# Altium schematic sheet 1_P1.schdoc
size 307 x 218 mm; Symbol: Drawing-Symbol_A4; Device: Drawing-Symbol_A4; @Project Name: usb_hub; @Page Count: 1; @Update Date: 2025-07-25; @Create Date: 2025-07-25; @Schematic Name: Schematic1; @Page No: 1; @Page Name: P1; Company: EasyEDA.com; Version: V1.0; Page Size: A4; @Create Time: 13:09:49; @Update Time: 22:19:45; Width: 1170; Height: 825; Region Start: 1; X Region Count: 6; Y Region Count: 4; Blade Width: 10; Title Block Position: 3; @Board Name: Board1
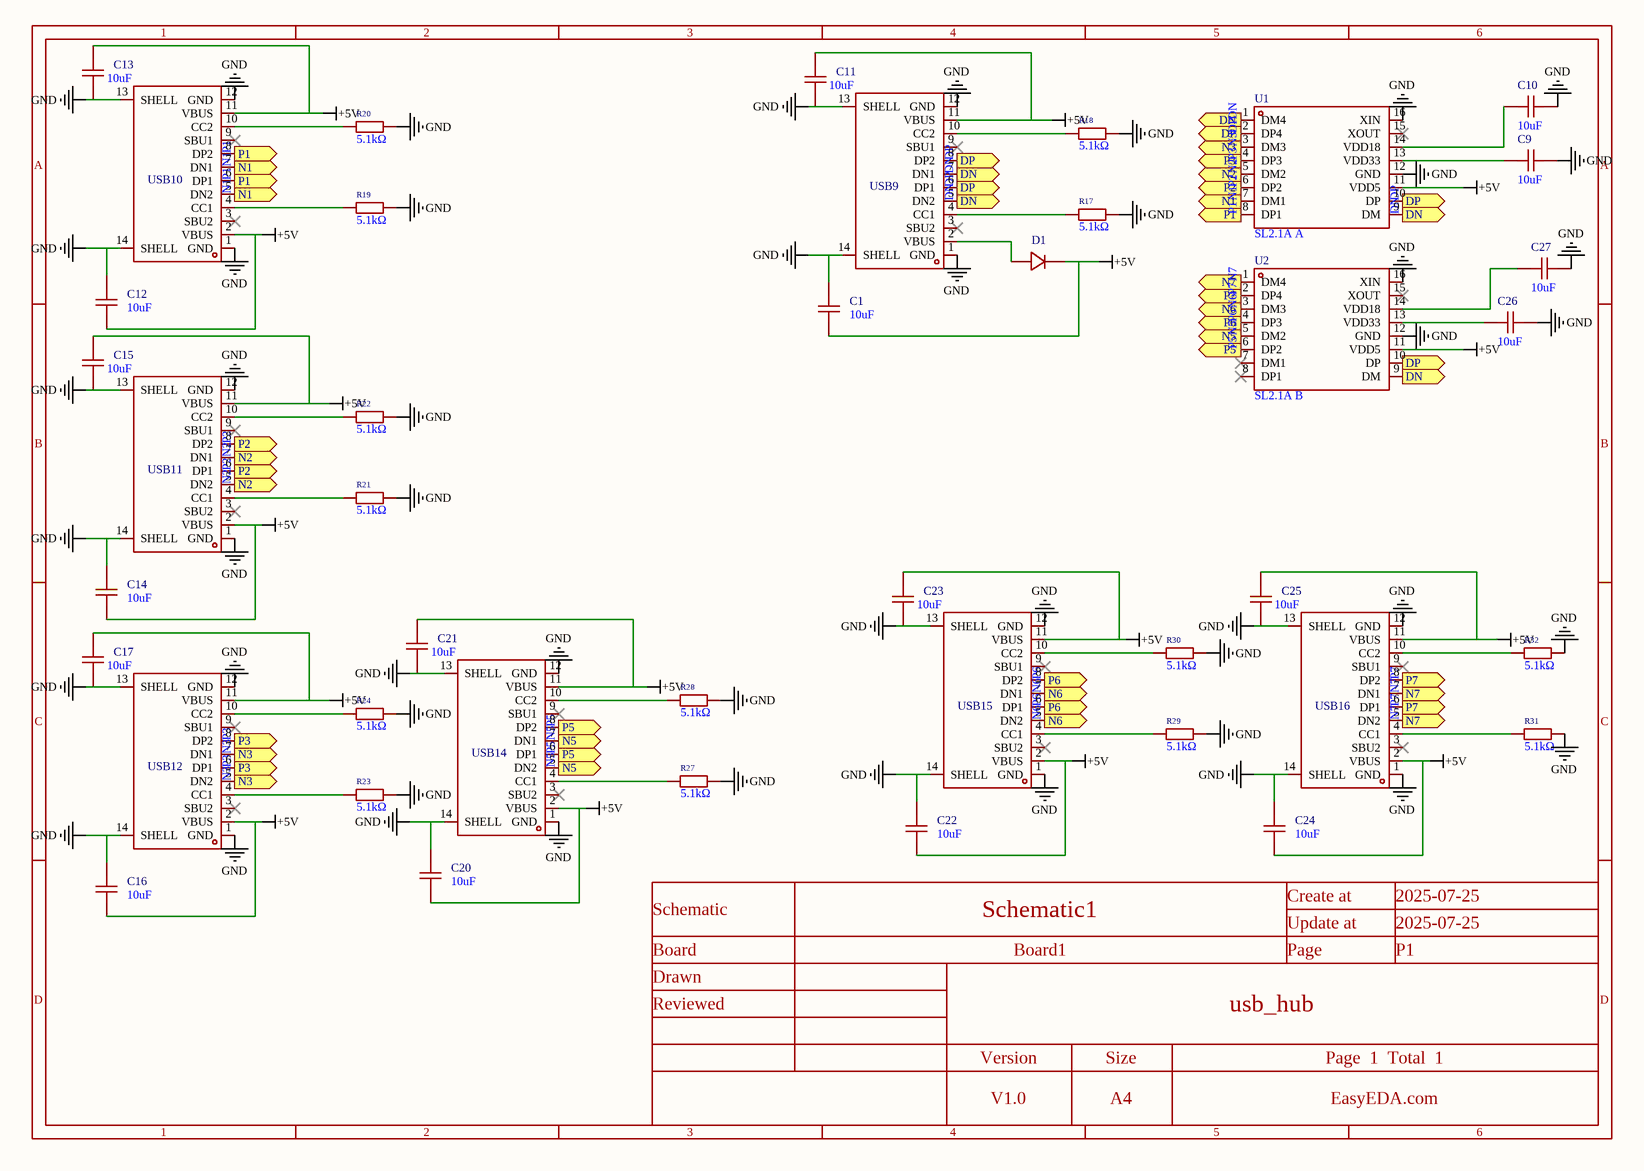
[diagram p0: 1_P1.schdoc]

## Parts
C1  10uF  [C0603]
C9  10uF  [C0603]
C10  10uF  [C0603]
C11  10uF  [C0603]
C12  10uF  [C0603]
C13  10uF  [C0603]
C14  10uF  [C0603]
C15  10uF  [C0603]
C16  10uF  [C0603]
C17  10uF  [C0603]
C20  10uF  [C0603]
C21  10uF  [C0603]
C22  10uF  [C0603]
C23  10uF  [C0603]
C24  10uF  [C0603]
C25  10uF  [C0603]
C26  10uF  [C0603]
C27  10uF  [C0603]
D1  NSR0320MW2T1G  [SOD-323_L1.8-W1.3-LS2.5-RD]  (value not drawn)
R17  5.1kΩ  [R0402]
R18  5.1kΩ  [R0402]
R19  5.1kΩ  [R0402]
R20  5.1kΩ  [R0402]
R21  5.1kΩ  [R0402]
R22  5.1kΩ  [R0402]
R23  5.1kΩ  [R0402]
R24  5.1kΩ  [R0402]
R27  5.1kΩ  [R0402]
R28  5.1kΩ  [R0402]
R29  5.1kΩ  [R0402]
R30  5.1kΩ  [R0402]
R31  5.1kΩ  [R0402]
R32  5.1kΩ  [R0402]
U1  SL2.1A A  [SOP-16_L10.0-W3.9-P1.27-LS6.0-BL]
U2  SL2.1A B  [SOP-16_L10.0-W3.9-P1.27-LS6.0-BL]
USB9  TYPE-C 16PIN 2MD(073)  [USB-C-SMD_TYPE-C-6PIN-2MD-073]  (value not drawn)
USB10  TYPE-C 16PIN 2MD(073)  [USB-C-SMD_TYPE-C-6PIN-2MD-073]  (value not drawn)
USB11  TYPE-C 16PIN 2MD(073)  [USB-C-SMD_TYPE-C-6PIN-2MD-073]  (value not drawn)
USB12  TYPE-C 16PIN 2MD(073)  [USB-C-SMD_TYPE-C-6PIN-2MD-073]  (value not drawn)
USB14  TYPE-C 16PIN 2MD(073)  [USB-C-SMD_TYPE-C-6PIN-2MD-073]  (value not drawn)
USB15  TYPE-C 16PIN 2MD(073)  [USB-C-SMD_TYPE-C-6PIN-2MD-073]  (value not drawn)
USB16  TYPE-C 16PIN 2MD(073)  [USB-C-SMD_TYPE-C-6PIN-2MD-073]  (value not drawn)

## Ports
DN (out), DP (out), N1 (out), N2 (out), N3 (out), N5 (out), N6 (out), N7 (out), P1 (out), P2 (out), P3 (out), P5 (out), P6 (out), P7 (out)

## Nets
+5V: C1.1 C11.1 C12.1 C13.1 C14.1 C15.1 C16.1 C17.1 C20.1 C21.1 C22.1 C23.1 C24.1 C25.1 D1.1(C) U1.11(VDD5) U2.11(VDD5) USB9.11(VBUS) USB10.2(VBUS) USB10.11(VBUS) USB11.2(VBUS) USB11.11(VBUS) USB12.2(VBUS) USB12.11(VBUS) USB14.2(VBUS) USB14.11(VBUS) USB15.2(VBUS) USB15.11(VBUS) USB16.2(VBUS) USB16.11(VBUS)
GND: C1.2 C9.1 C10.1 C11.2 C12.2 C13.2 C14.2 C15.2 C16.2 C17.2 C20.2 C21.2 C22.2 C23.2 C24.2 C25.2 C26.1 C27.1 R17.1 R18.1 R19.1 R20.1 R21.1 R22.1 R23.1 R24.1 R27.1 R28.1 R29.1 R30.1 R31.1 R32.1 U1.12(GND) U1.16(XIN) U2.12(GND) U2.16(XIN) USB9.1(GND) USB9.12(GND) USB9.13(SHELL) USB9.14(SHELL) USB10.1(GND) USB10.12(GND) USB10.13(SHELL) USB10.14(SHELL) USB11.1(GND) USB11.12(GND) USB11.13(SHELL) USB11.14(SHELL) USB12.1(GND) USB12.12(GND) USB12.13(SHELL) USB12.14(SHELL) USB14.1(GND) USB14.12(GND) USB14.13(SHELL) USB14.14(SHELL) USB15.1(GND) USB15.12(GND) USB15.13(SHELL) USB15.14(SHELL) USB16.1(GND) USB16.12(GND) USB16.13(SHELL) USB16.14(SHELL)
DN: U1.1(DM4) U1.9(DM) U2.9(DM) USB9.5(DN2) USB9.7(DN1) ; port DN
DP: U1.2(DP4) U1.10(DP) U2.10(DP) USB9.6(DP1) USB9.8(DP2) ; port DP
N1: U1.7(DM1) USB10.5(DN2) USB10.7(DN1) ; port N1
N2: U1.5(DM2) USB11.5(DN2) USB11.7(DN1) ; port N2
N3: U1.3(DM3) USB12.5(DN2) USB12.7(DN1) ; port N3
N5: U2.5(DM2) USB14.5(DN2) USB14.7(DN1) ; port N5
N6: U2.3(DM3) USB15.5(DN2) USB15.7(DN1) ; port N6
N7: U2.1(DM4) USB16.5(DN2) USB16.7(DN1) ; port N7
P1: U1.8(DP1) USB10.6(DP1) USB10.8(DP2) ; port P1
P2: U1.6(DP2) USB11.6(DP1) USB11.8(DP2) ; port P2
P3: U1.4(DP3) USB12.6(DP1) USB12.8(DP2) ; port P3
P5: U2.6(DP2) USB14.6(DP1) USB14.8(DP2) ; port P5
P6: U2.4(DP3) USB15.6(DP1) USB15.8(DP2) ; port P6
P7: U2.2(DP4) USB16.6(DP1) USB16.8(DP2) ; port P7
NetC9_2: C9.2 U1.13(VDD33)
NetC10_2: C10.2 U1.14(VDD18)
NetC26_2: C26.2 U2.13(VDD33)
NetC27_2: C27.2 U2.14(VDD18)
NetD1_2: D1.2(A) USB9.2(VBUS)
NetR17_2: R17.2 USB9.4(CC1)
NetR18_2: R18.2 USB9.10(CC2)
NetR19_2: R19.2 USB10.4(CC1)
NetR20_2: R20.2 USB10.10(CC2)
NetR21_2: R21.2 USB11.4(CC1)
NetR22_2: R22.2 USB11.10(CC2)
NetR23_2: R23.2 USB12.4(CC1)
NetR24_2: R24.2 USB12.10(CC2)
NetR27_2: R27.2 USB14.4(CC1)
NetR28_2: R28.2 USB14.10(CC2)
NetR29_2: R29.2 USB15.4(CC1)
NetR30_2: R30.2 USB15.10(CC2)
NetR31_2: R31.2 USB16.4(CC1)
NetR32_2: R32.2 USB16.10(CC2)

Not connected (* = marked no-connect by the designer): U1 15(XOUT)*; U2 7(DM1)* 8(DP1)* 15(XOUT)*; USB9 3(SBU2)* 9(SBU1)*; USB10 3(SBU2)* 9(SBU1)*; USB11 3(SBU2)* 9(SBU1)*; USB12 3(SBU2)* 9(SBU1)*; USB14 3(SBU2)* 9(SBU1)*; USB15 3(SBU2)* 9(SBU1)*; USB16 3(SBU2)* 9(SBU1)*

## Notes on the sheet
- 1
- 2
- 3
- 4
- 5
- 6
- A
- B
- C
- Schematic
- Schematic1
- Create at
- Update at
- 2025-07-25
- Board
- Drawn
- Board1
- Page
- P1
- D
- Reviewed
- Version
- Size
- usb_hub
- Page  1  Total  1
- V1.0
- A4
- EasyEDA.com

## Library data of the parts
C1 C9-C17 C20-C27 = CL10A106KP8NNNC: Manufacturer: SAMSUNG(三星); Add into BOM: yes; Tolerance: ±10%; Symbol: CL10A106KP8NNNC; Device: CL10A106KP8NNNC; LCSC Part Name: 10uF ±10% 10V; Supplier Part: C19702; Manufacturer Part: CL10A106KP8NNNC; Supplier Footprint: 0603; JLCPCB Part Class: Basic Part; Datasheet: https://atta.szlcsc.com/upload/public/pdf/source/20160218/1457707763339.pdf; Supplier: LCSC; Convert to PCB: yes; Value: 10uF
D1 = NSR0320MW2T1G: Manufacturer: onsemi(安森美); Add into BOM: yes; Forward Voltage (Vf@If): 500mV@900mA; Reverse Voltage (Vr): 20V; Average Rectified Current (Io): 1A; Reverse Leakage Current (Ir): 50uA@15V; Symbol: NSR0320MW2T1G; Device: NSR0320MW2T1G; LCSC Part Name: 电压:20V 电流:1A; Supplier Part: C48192; Manufacturer Part: NSR0320MW2T1G; Supplier Footprint: SOD-323; JLCPCB Part Class: Extended Part; Datasheet: https://atta.szlcsc.com/upload/public/pdf/source/20170225/1488010654203.PDF; Supplier: LCSC; Convert to PCB: yes
R17-R24 R27-R32 = 0402WGF5101TCE: Manufacturer: UNI-ROYAL(厚声); Add into BOM: yes; Tolerance: ±1%; Temperature Coefficient: ±100ppm/℃; Symbol: 0402WGF5101TCE; Device: 0402WGF5101TCE; Supplier: LCSC; Manufacturer Part: 0402WGF5101TCE; Supplier Part: C25905; Value: 5.1kΩ; JLCPCB Part Class: Basic Part; LCSC Part Name: 5.1kΩ ±1% 62.5mW 厚膜电阻; Supplier Footprint: 0402; Datasheet: https://atta.szlcsc.com/upload/public/pdf/source/20200306/C422600_1E6D84923E4A46A82E41ADD87F860B5C.pdf; Convert to PCB: yes; Type: Thick Film Resistors; Operating Temperature Range: -55℃~+155℃
U1 U2 = SL2.1A: Manufacturer: CoreChips(和芯润德); Add into BOM: yes; Symbol: SL2.1A; Device: SL2.1A; LCSC Part Name: USB2.0高速4端口HUB控制器; Supplier Part: C192893; Supplier Footprint: SOP-16; JLCPCB Part Class: Extended Part; Datasheet: https://atta.szlcsc.com/upload/public/pdf/source/20180522/C192893_624110D24898D57AAC785E3DF98EA862.pdf; Supplier: LCSC; Convert to PCB: yes
  U1: Manufacturer Part: SL2.1A A
  U2: Manufacturer Part: SL2.1A B
USB9-USB12 USB14-USB16 = TYPE-C 16PIN 2MD(073): Manufacturer: SHOU HAN(首韩); Add into BOM: yes; Protocol Standard: USB 3.1; Gender: Female; Number of Contacts: 16P; Number of Ports: 1; Current Rating-Power: 3A; Voltage Rating: 5V; Connect-Disconnect Life: 5,000 Cycles; Detection color: Black; Symbol: TYPE-C 16PIN 2MD(073); Device: TYPE-C 16PIN 2MD(073); LCSC Part Name: Type-C 母 卧贴; Supplier Part: C2765186; Manufacturer Part: TYPE-C 16PIN 2MD(073); Supplier Footprint: SMD; JLCPCB Part Class: Extended Part; Datasheet: https://atta.szlcsc.com/upload/public/pdf/source/20250506/FFB74EDFDFA0AC372CE4A8E4F739CCEF.pdf; Supplier: LCSC; Convert to PCB: yes; Connector Type: Type-C; Mounting Type: Surface Mount, Right Angle; Supplementary Features: -; Center Height: -; Length: -; Operating Temperature: -25℃~+85℃